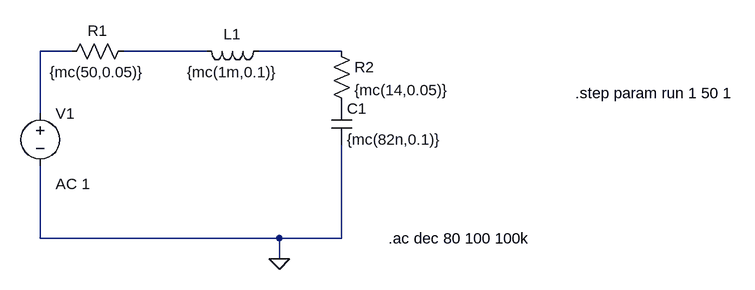
[diagram p0: schematic 2_2_MC.asc]
2_2_MC.asc, the LTspice schematic file:
Version 4.1
SHEET 1 1140 680
WIRE 96 48 48 48
WIRE 304 48 176 48
WIRE 512 48 384 48
WIRE 48 144 48 48
WIRE 48 336 48 224
WIRE 416 336 48 336
WIRE 512 336 512 192
WIRE 512 336 416 336
WIRE 416 368 416 336
FLAG 416 368 0
SYMBOL voltage 48 128 R0
WINDOW 123 24 124 Left 2
WINDOW 39 0 0 Left 0
SYMATTR Value2 AC 1
SYMATTR InstName V1
SYMATTR Value ""
SYMBOL res 192 32 R90
WINDOW 0 0 56 VBottom 2
WINDOW 3 32 56 VTop 2
SYMATTR InstName R1
SYMATTR Value {mc(50,0.05)}
SYMBOL ind 400 32 R90
WINDOW 0 5 56 VBottom 2
WINDOW 3 32 56 VTop 2
SYMATTR InstName L1
SYMATTR Value {mc(1m,0.1)}
SYMATTR SpiceLine Rser=1m
SYMBOL cap 496 128 R0
SYMATTR InstName C1
SYMATTR Value {mc(82n,0.1)}
SYMBOL res 496 32 R0
SYMATTR InstName R2
SYMATTR Value {mc(14,0.05)}
TEXT 584 336 Left 2 !.ac dec 80 100 100k
TEXT 872 112 Left 2 !.step param run 1 50 1

The netlist it stands for:
* 2_2_MC.asc
V1 N001 0 AC 1
R1 N002 N001 {mc(50,0.05)}
L1 N003 N002 {mc(1m,0.1)} Rser=1m
C1 P001 0 {mc(82n,0.1)}
R2 N003 P001 {mc(14,0.05)}
.ac dec 80 100 100k
.step param run 1 50 1
.backanno
.end